# Altium schematic sheet 小车主板原理图2.SchDoc
size A3
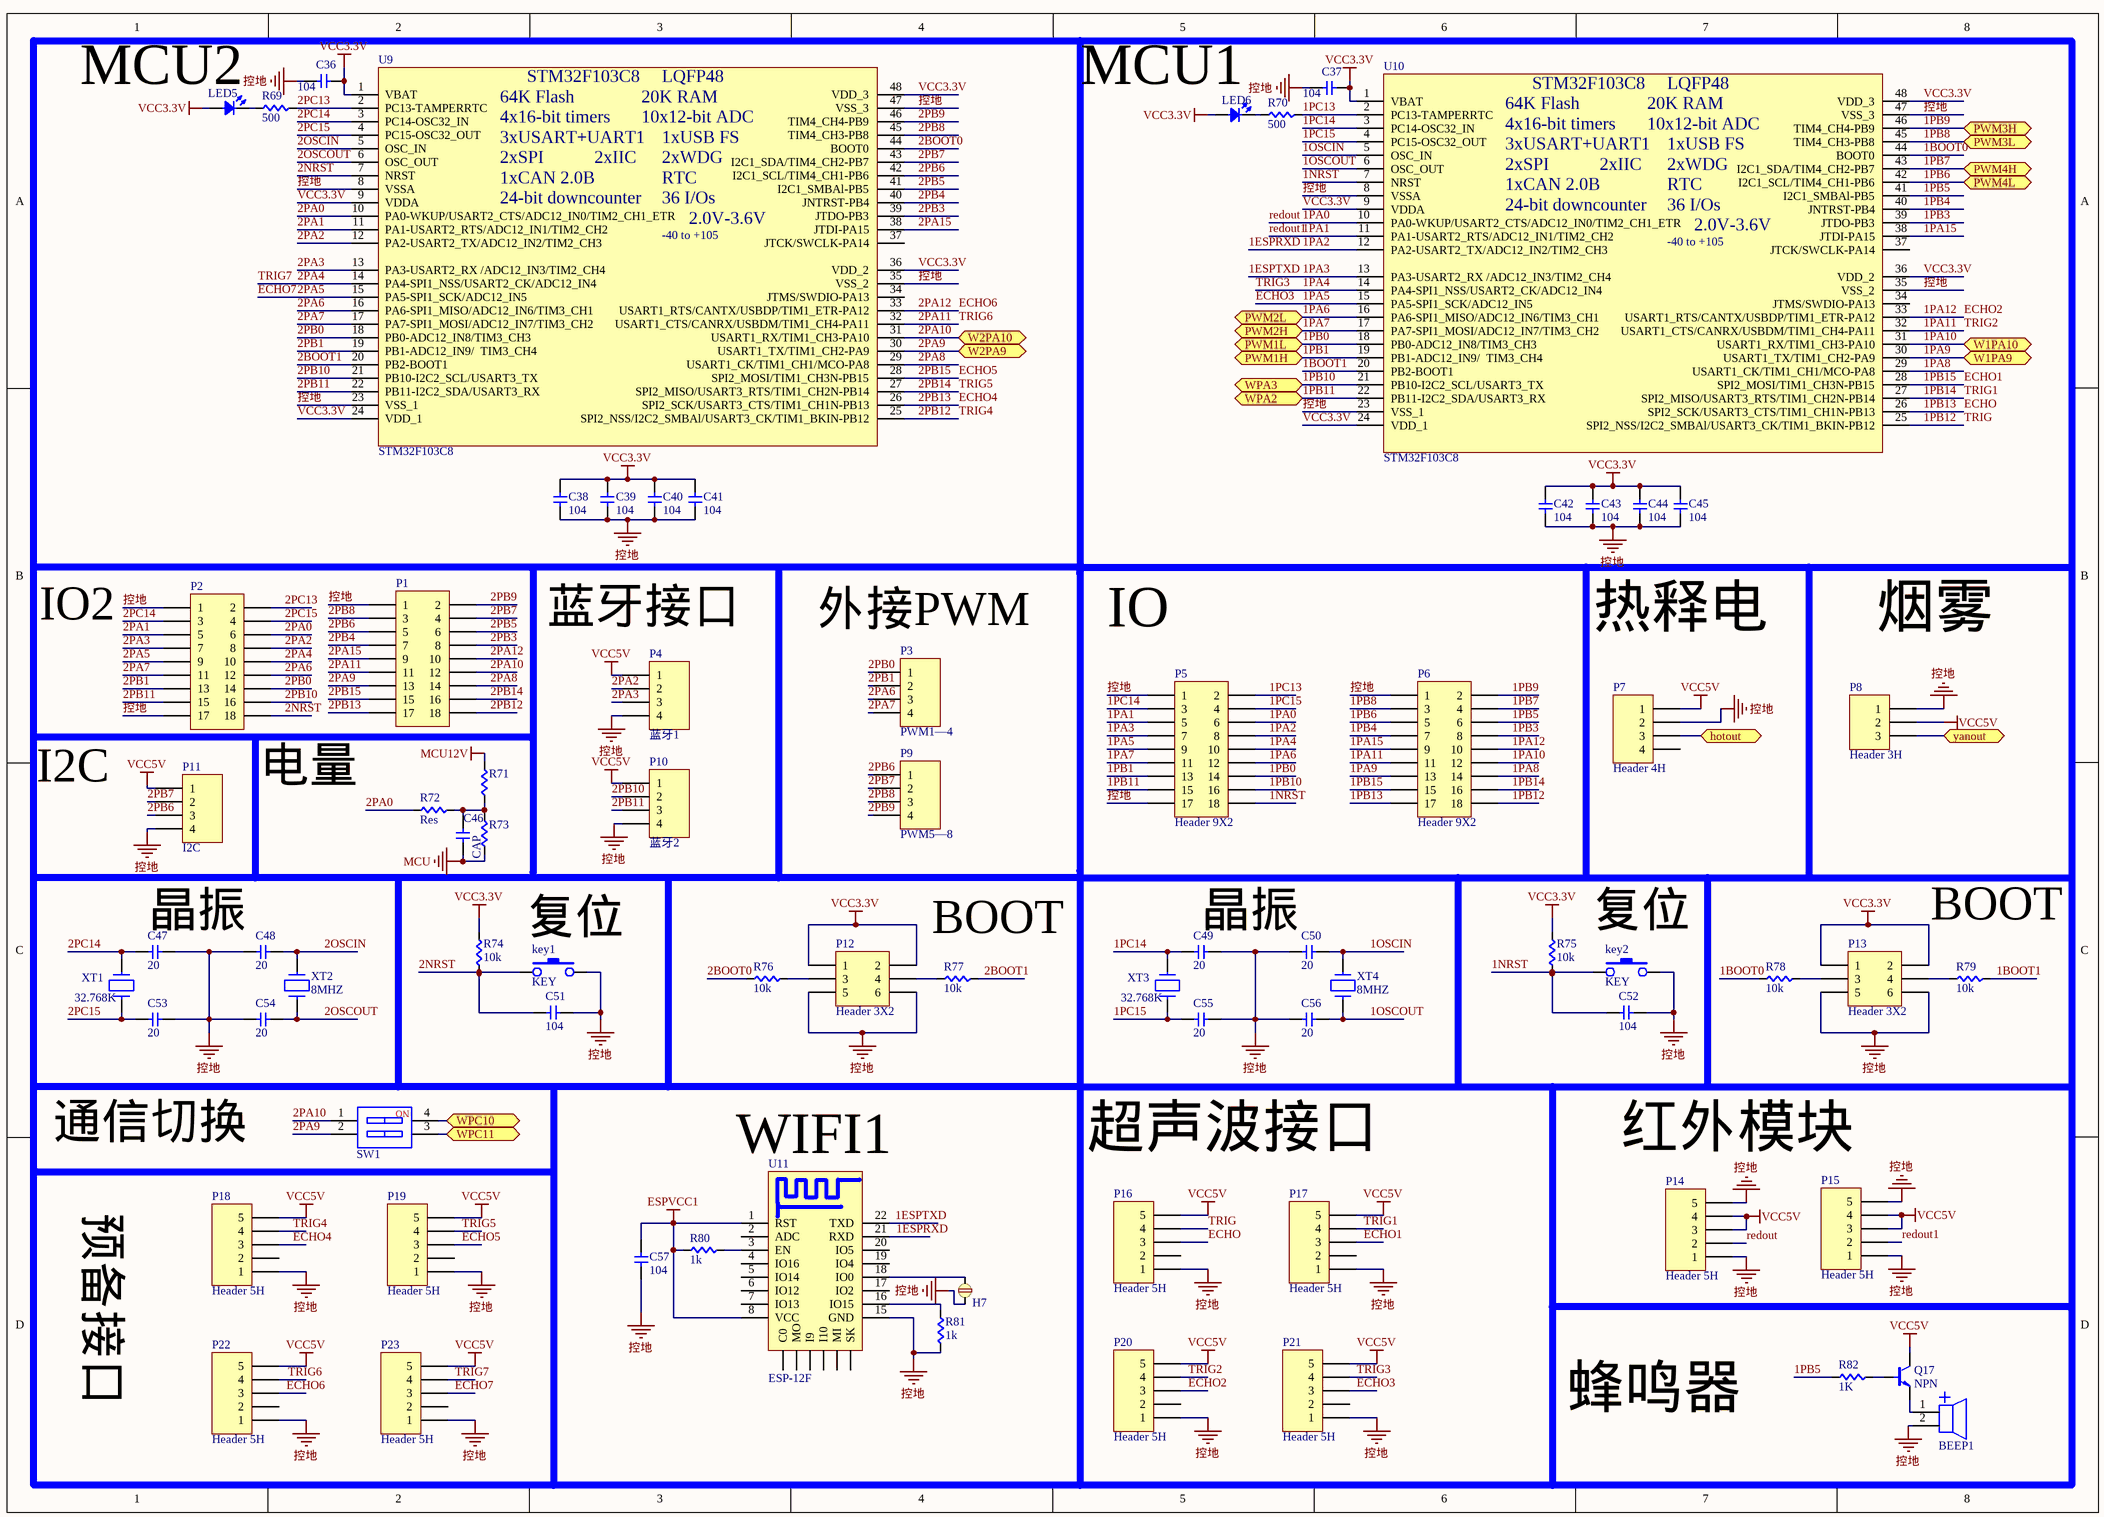
[diagram p0: 小车主板原理图2.SchDoc]

## Parts
BEEP1  5V有源蜂鸣器  [5V蜂鸣器]  (value not drawn)
C36  104  [0805C]
C37  104  [0805C]
C38  104  [0805C]
C39  104  [0805C]
C40  104  [0805C]
C41  104  [0805C]
C42  104  [0805C]
C43  104  [0805C]
C44  104  [0805C]
C45  104  [0805C]
C46  CAP  [0805C]
C47  20  [0805C]
C48  20  [0805C]
C49  20  [0805C]
C50  20  [0805C]
C51  104  [0805C]
C52  104  [0805C]
C53  20  [0805C]
C54  20  [0805C]
C55  20  [0805C]
C56  20  [0805C]
C57  104  [0805C]
H7  2脚  [2P]  (value not drawn)
key1  KEY  [按键DIP-3*6*5]
key2  KEY  [按键DIP-3*6*5]
LED5  LED  [0805D]  (value not drawn)
LED6  LED  [0805D]  (value not drawn)
P1  (no value)  [HDR2X9]
P2  (no value)  [HDR2X9]
P3  PWM1—4  [PZ_XH-2.54-4P]
P4  蓝牙1  [PZ_XH-2.54-4P]
P5  Header 9X2  [HDR2X9]
P6  Header 9X2  [HDR2X9]
P7  Header 4H  [PZ_XH-2.54-4P]
P8  Header 3H  [PZ_XH-2.54-3P]
P9  PWM5—8  [PZ_XH-2.54-4P]
P10  蓝牙2  [PZ_XH-2.54-4P]
P11  I2C  [PZ_XH-2.54-4P]
P12  Header 3X2  [HDR2X3]
P13  Header 3X2  [HDR2X3]
P14  Header 5H  [PZ_XH-2.54-5P]
P15  Header 5H  [PZ_XH-2.54-5P]
P16  Header 5H  [PZ_XH-2.54-5P]
P17  Header 5H  [PZ_XH-2.54-5P]
P18  Header 5H  [PZ_XH-2.54-5P]
P19  Header 5H  [PZ_XH-2.54-5P]
P20  Header 5H  [PZ_XH-2.54-5P]
P21  Header 5H  [PZ_XH-2.54-5P]
P22  Header 5H  [PZ_XH-2.54-5P]
P23  Header 5H  [PZ_XH-2.54-5P]
Q17  NPN  [SOT-23]
R69  500  [0805]
R70  500  [0805]
R71  (no value)  [0805]
R72  Res  [0805]
R73  (no value)  [0805]
R74  10k  [0805]
R75  10k  [0805]
R76  10k  [0805]
R77  10k  [0805]
R78  10k  [0805]
R79  10k  [0805]
R80  1k  [0805]
R81  1k  [0805]
R82  1K  [0805]
SW1  CSW-2P  [CSW DIP-2P]  (value not drawn)
U9  STM32F103C8  [TQFP48]
U10  STM32F103C8  [TQFP48]
U11  ESP-12F  [ESP-12F]
XT1  32.768K  [XTAL-T]
XT2  8MHZ  [XTAL-T]
XT3  32.768K  [XTAL-T]
XT4  8MHZ  [XTAL-T]

## Ports
hotout, PWM1H, PWM1L, PWM2H, PWM2L, PWM3H, PWM3L, PWM4H, PWM4L, W1PA9, W1PA10, W2PA9, W2PA10, WPA2, WPA3, WPC10, WPC11, yanout

## Nets
ESPVCC1: C57.2 R80.1 U11.1(RST) U11.8(VCC)
MCU: C46.1 R73.1
MCU12V: R71.2
VCC3.3V: C36.2 C37.2 C38.2 C39.2 C40.2 C41.2 C42.2 C43.2 C44.2 C45.2 LED5.1(A) LED6.1(A) P12.1 P12.2 P13.1 P13.2 R74.2 R75.2 U9.1(VBAT) U9.9(VDDA) U9.24(VDD_1) U9.36(VDD_2) U9.48(VDD_3) U10.1(VBAT) U10.9(VDDA) U10.24(VDD_1) U10.36(VDD_2) U10.48(VDD_3)
VCC5V: P4.1 P7.1 P8.2 P10.1 P11.1 P14.3 P14.4 P15.3 P15.4 P16.5 P17.5 P18.5 P19.5 P20.5 P21.5 P22.5 P23.5 Q17.1(c)
控地: BEEP1.2(GND) C36.1 C37.1 C38.1 C39.1 C40.1 C41.1 C42.1 C43.1 C44.1 C45.1 C47.1 C48.1 C49.1 C50.1 C51.2 C52.2 C53.1 C54.1 C55.1 C56.1 C57.1 H7.1 key1.2 key2.2 P1.1 P2.1 P2.17 P4.4 P5.1 P5.17 P6.1 P7.2 P8.1 P10.4 P11.4 P12.5 P12.6 P13.5 P13.6 P14.1 P14.5 P15.1 P15.5 P16.1 P17.1 P18.1 P19.1 P20.1 P21.1 P22.1 P23.1 R81.1 U9.8(VSSA) U9.23(VSS_1) U9.35(VSS_2) U9.47(VSS_3) U10.8(VSSA) U10.23(VSS_1) U10.35(VSS_2) U10.47(VSS_3) U11.15(GND)
1BOOT0: R78.2 U10.44(BOOT0)
1BOOT1: R79.1 U10.20(PB2-BOOT1)
1ESPRXD: P5.8 U10.12(PA2-USART2_TX/ADC12_IN2/TIM2_CH3) U11.21(RXD)  [also labelled 1PA2]
1ESPTXD: P5.7 U10.13(PA3-USART2_RX_/ADC12_IN3/TIM2_CH4) U11.22(TXD)  [also labelled 1PA3]
1NRST: C52.1 key2.1 P5.18 R75.1 U10.7(NRST)
1OSCIN: C50.2 U10.5(OSC_IN) XT4.2
1OSCOUT: C56.2 U10.6(OSC_OUT) XT4.1
1PA0: P5.6 P14.2 U10.10(PA0-WKUP/USART2_CTS/ADC12_IN0/TIM2_CH1_ETR)  [also labelled redout]
1PA1: P5.5 P15.2 U10.11(PA1-USART2_RTS/ADC12_IN1/TIM2_CH2)  [also labelled redout1]
1PA4: P5.10 P21.4 U10.14(PA4-SPI1_NSS/USART2_CK/ADC12_IN4)  [also labelled TRIG3]
1PA5: P5.9 P21.3 U10.15(PA5-SPI1_SCK/ADC12_IN5)  [also labelled ECHO3]
1PA6: P5.12 U10.16(PA6-SPI1_MISO/ADC12_IN6/TIM3_CH1) ; port PWM2L
1PA7: P5.11 U10.17(PA7-SPI1_MOSI/ADC12_IN7/TIM3_CH2) ; port PWM2H
1PA8: P6.14 U10.29(USART1_CK/TIM1_CH1/MCO-PA8)
1PA9: P6.13 U10.30(USART1_TX/TIM1_CH2-PA9) ; port W1PA9
1PA10: P6.12 U10.31(USART1_RX/TIM1_CH3-PA10) ; port W1PA10
1PA11: P6.11 P20.4 U10.32(USART1_CTS/CANRX/USBDM/TIM1_CH4-PA11)  [also labelled TRIG2]
1PA12: P6.10 P20.3 U10.33(USART1_RTS/CANTX/USBDP/TIM1_ETR-PA12)  [also labelled ECHO2]
1PA15: P6.9 U10.38(JTDI-PA15)
1PB0: P5.14 U10.18(PB0-ADC12_IN8/TIM3_CH3) ; port PWM1L
1PB1: P5.13 U10.19(PB1-ADC12_IN9/__TIM3_CH4) ; port PWM1H
1PB3: P6.8 U10.39(JTDO-PB3)
1PB4: P6.7 U10.40(JNTRST-PB4)
1PB5: P6.6 R82.1 U10.41(I2C1_SMBAl-PB5)
1PB6: P6.5 U10.42(I2C1_SCL/TIM4_CH1-PB6) ; port PWM4L
1PB7: P6.4 U10.43(I2C1_SDA/TIM4_CH2-PB7) ; port PWM4H
1PB8: P6.3 U10.45(TIM4_CH3-PB8) ; port PWM3L
1PB9: P6.2 U10.46(TIM4_CH4-PB9) ; port PWM3H
1PB10: P5.16 U10.21(PB10-I2C2_SCL/USART3_TX) ; port WPA3
1PB11: P5.15 U10.22(PB11-I2C2_SDA/USART3_RX) ; port WPA2
1PB12: P6.18 P16.4 U10.25(SPI2_NSS/I2C2_SMBAl/USART3_CK/TIM1_BKIN-PB12)  [also labelled TRIG]
1PB13: P6.17 P16.3 U10.26(SPI2_SCK/USART3_CTS/TIM1_CH1N-PB13)  [also labelled ECHO]
1PB14: P6.16 P17.4 U10.27(SPI2_MISO/USART3_RTS/TIM1_CH2N-PB14)  [also labelled TRIG1]
1PB15: P6.15 P17.3 U10.28(SPI2_MOSI/TIM1_CH3N-PB15)  [also labelled ECHO1]
1PC13: P5.2 R70.2 U10.2(PC13-TAMPERRTC)
1PC14: C49.2 P5.3 U10.3(PC14-OSC32_IN) XT3.1
1PC15: C55.2 P5.4 U10.4(PC15-OSC32_OUT) XT3.2
2BOOT0: R76.2 U9.44(BOOT0)
2BOOT1: R77.1 U9.20(PB2-BOOT1)
2NRST: C51.1 key1.1 P2.18 R74.1 U9.7(NRST)
2OSCIN: C48.2 U9.5(OSC_IN) XT2.2
2OSCOUT: C54.2 U9.6(OSC_OUT) XT2.1
2PA0: P2.6 R72.2 U9.10(PA0-WKUP/USART2_CTS/ADC12_IN0/TIM2_CH1_ETR)
2PA1: P2.5 U9.11(PA1-USART2_RTS/ADC12_IN1/TIM2_CH2)
2PA2: P2.8 P4.2 U9.12(PA2-USART2_TX/ADC12_IN2/TIM2_CH3)
2PA3: P2.7 P4.3 U9.13(PA3-USART2_RX_/ADC12_IN3/TIM2_CH4)
2PA4: P2.10 P23.4 U9.14(PA4-SPI1_NSS/USART2_CK/ADC12_IN4)  [also labelled TRIG7]
2PA5: P2.9 P23.3 U9.15(PA5-SPI1_SCK/ADC12_IN5)  [also labelled ECHO7]
2PA6: P2.12 P3.3 U9.16(PA6-SPI1_MISO/ADC12_IN6/TIM3_CH1)
2PA7: P2.11 P3.4 U9.17(PA7-SPI1_MOSI/ADC12_IN7/TIM3_CH2)
2PA8: P1.14 U9.29(USART1_CK/TIM1_CH1/MCO-PA8)
2PA9: P1.13 SW1.2 U9.30(USART1_TX/TIM1_CH2-PA9) ; port W2PA9
2PA10: P1.12 SW1.1 U9.31(USART1_RX/TIM1_CH3-PA10) ; port W2PA10
2PA11: P1.11 P22.4 U9.32(USART1_CTS/CANRX/USBDM/TIM1_CH4-PA11)  [also labelled TRIG6]
2PA12: P1.10 P22.3 U9.33(USART1_RTS/CANTX/USBDP/TIM1_ETR-PA12)  [also labelled ECHO6]
2PA15: P1.9 U9.38(JTDI-PA15)
2PB0: P2.14 P3.1 U9.18(PB0-ADC12_IN8/TIM3_CH3)
2PB1: P2.13 P3.2 U9.19(PB1-ADC12_IN9/__TIM3_CH4)
2PB3: P1.8 U9.39(JTDO-PB3)
2PB4: P1.7 U9.40(JNTRST-PB4)
2PB5: P1.6 U9.41(I2C1_SMBAl-PB5)
2PB6: P1.5 P9.1 P11.3 U9.42(I2C1_SCL/TIM4_CH1-PB6)
2PB7: P1.4 P9.2 P11.2 U9.43(I2C1_SDA/TIM4_CH2-PB7)
2PB8: P1.3 P9.3 U9.45(TIM4_CH3-PB8)
2PB9: P1.2 P9.4 U9.46(TIM4_CH4-PB9)
2PB10: P2.16 P10.2 U9.21(PB10-I2C2_SCL/USART3_TX)
2PB11: P2.15 P10.3 U9.22(PB11-I2C2_SDA/USART3_RX)
2PB12: P1.18 P18.4 U9.25(SPI2_NSS/I2C2_SMBAl/USART3_CK/TIM1_BKIN-PB12)  [also labelled TRIG4]
2PB13: P1.17 P18.3 U9.26(SPI2_SCK/USART3_CTS/TIM1_CH1N-PB13)  [also labelled ECHO4]
2PB14: P1.16 P19.4 U9.27(SPI2_MISO/USART3_RTS/TIM1_CH2N-PB14)  [also labelled TRIG5]
2PB15: P1.15 P19.3 U9.28(SPI2_MOSI/TIM1_CH3N-PB15)  [also labelled ECHO5]
2PC13: P2.2 R69.2 U9.2(PC13-TAMPERRTC)
2PC14: C47.2 P2.3 U9.3(PC14-OSC32_IN) XT1.1
2PC15: C53.2 P2.4 U9.4(PC15-OSC32_OUT) XT1.2
hotout: P7.3 ; port hotout
WPC10: SW1.4 ; port WPC10
WPC11: SW1.3 ; port WPC11
yanout: P8.3 ; port yanout
NetBEEP1_1: BEEP1.1(VCC) Q17.2(e)
NetC46_2: C46.2 R71.1 R72.1 R73.2
NetH7_2: H7.2 U11.18(IO0)
NetLED5_2: LED5.2(K) R69.1
NetLED6_2: LED6.2(K) R70.1
NetP12_3: P12.3 R76.1
NetP12_4: P12.4 R77.2
NetP13_3: P13.3 R78.1
NetP13_4: P13.4 R79.2
NetQ17_3: Q17.3(b) R82.2
NetR80_2: R80.2 U11.3(EN)
NetR81_2: R81.2 U11.16(IO15)

Not connected (* = marked no-connect by the designer): P7 4; P16 2; P17 2; P18 2; P19 2; P20 2; P21 2; P22 2; P23 2; U9 34(JTMS/SWDIO-PA13) 37(JTCK/SWCLK-PA14); U10 34(JTMS/SWDIO-PA13) 37(JTCK/SWCLK-PA14); U11 2(ADC) 4(IO16) 5(IO14) 6(IO12) 7(IO13) 9(C0) 10(MO) 11(I9) 12(I10) 13(MI) 14(SK) 17(IO2) 19(IO4) 20(IO5)

## Notes on the sheet
- (near LED5) MCU2
- (near LED6) MCU1
- IO2
- (near P4) 蓝牙接口
- (near P3) 外接PWM
- IO
- 热释电
- 烟雾
- I2C
- (near P2) 电量
- BOOT
- (near C47) 晶振
- (near key1) 复位
- (near C49) 晶振
- 复位
- 通信切换
- WIFI1
- 超声波接口
- (near P14) 红外模块
- 预备接口
- 蜂鸣器
- (in symbol CSW-2P) NO
- (in symbol STM32F103C8) LQFP48; 64K Flash; 20K RAM; 4x16-bit timers; 10x12-bit ADC; 3xUSART+UART1; 1xUSB FS; 2xSPI; 2xIIC; 2xWDG; 1xCAN 2.0B; RTC; 24-bit downcounter; 36 I/Os; 2.0V-3.6V; -40 to +105

## Library data of the parts
C36-C57 = C
P1 P2 P5 P6 = Header 9X2: Header, 9-Pin, Dual row; LatestRevisionDate: 17-Jul-2002; LatestRevisionNote: Re-released for DXP Platform.; Publisher: Altium Limited
P3 P4 P7 P9-P11 = Header 4H: Header, 4-Pin, Right Angle; LatestRevisionDate: 17-Jul-2002; LatestRevisionNote: Re-released for DXP Platform.; Publisher: Altium Limited
P8 = Header 3H: Header, 3-Pin, Right Angle; LatestRevisionDate: 17-Jul-2002; LatestRevisionNote: Re-released for DXP Platform.; Publisher: Altium Limited
P12 P13 = Header 3X2: Header, 3-Pin, Dual row; LatestRevisionDate: 17-Jul-2002; LatestRevisionNote: Re-released for DXP Platform.; Publisher: Altium Limited
P14-P23 = Header 5H: Header, 5-Pin, Right Angle; LatestRevisionDate: 17-Jul-2002; LatestRevisionNote: Re-released for DXP Platform.; Publisher: Altium Limited
R69-R71 R73-R82 = Res
SW1 = CSW-2P: 2路编码开关; 版权归属: 源创客; BOM名称: 2路编码开关; 学习资源: www.ooocke.com
XT1-XT4 = XTAL
LED5 LED6 = LED: Published: 8-Jun-2000; LatestRevisionDate: 08-Jul-2005; LatestRevisionNote: Mech Layer 1 removed.; PackageReference: LED-0; Publisher: Altium Limited; PackageDescription: LED; 2 Leads